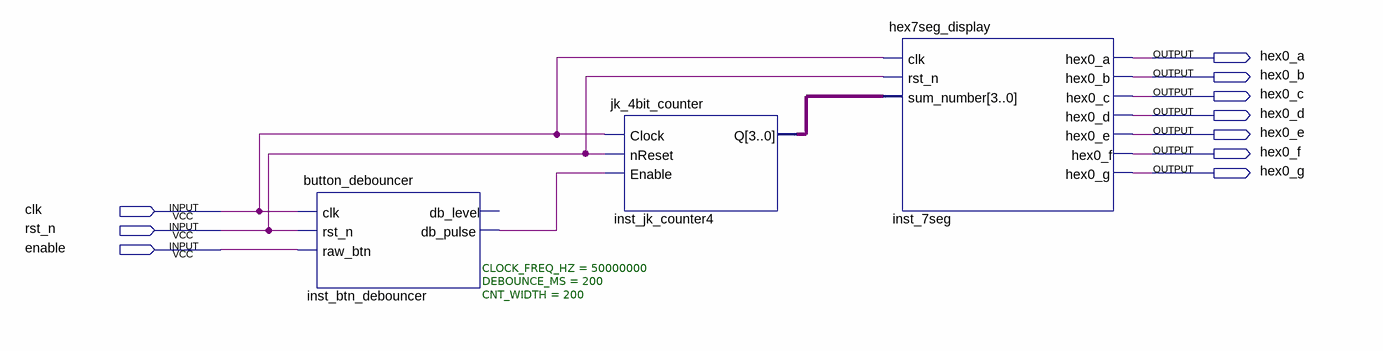
[diagram p0: schematic sheet]
// Quartus schematic top_jk_counter.bdf as structural Verilog: 3 symbols, 10 pins
module top_jk_counter (
  input  clk,
  input  rst_n,
  input  enable,
  output hex0_a,
  output hex0_b,
  output hex0_c,
  output hex0_d,
  output hex0_e,
  output hex0_f,
  output hex0_g
);

  wire inst_btn_debouncer_db_pulse;
  wire [3:0] inst_jk_counter4_q;

  button_debouncer #(.CLOCK_FREQ_HZ(50000000), .DEBOUNCE_MS(200), .CNT_WIDTH(200)) inst_btn_debouncer (
    .clk(clk), .rst_n(rst_n), .raw_btn(enable), .db_pulse(inst_btn_debouncer_db_pulse));  // open: db_level
  jk_4bit_counter inst_jk_counter4 (
    .Clock(clk), .nReset(rst_n), .Enable(inst_btn_debouncer_db_pulse), .Q(inst_jk_counter4_q));
  hex7seg_display inst_7seg (
    .clk(clk), .rst_n(rst_n), .sum_number(inst_jk_counter4_q), .hex0_a(hex0_a), .hex0_b(hex0_b),
    .hex0_c(hex0_c), .hex0_d(hex0_d), .hex0_e(hex0_e), .hex0_f(hex0_f), .hex0_g(hex0_g));
endmodule
